# EAGLE design displayboard (EAGLE 6.6.0)
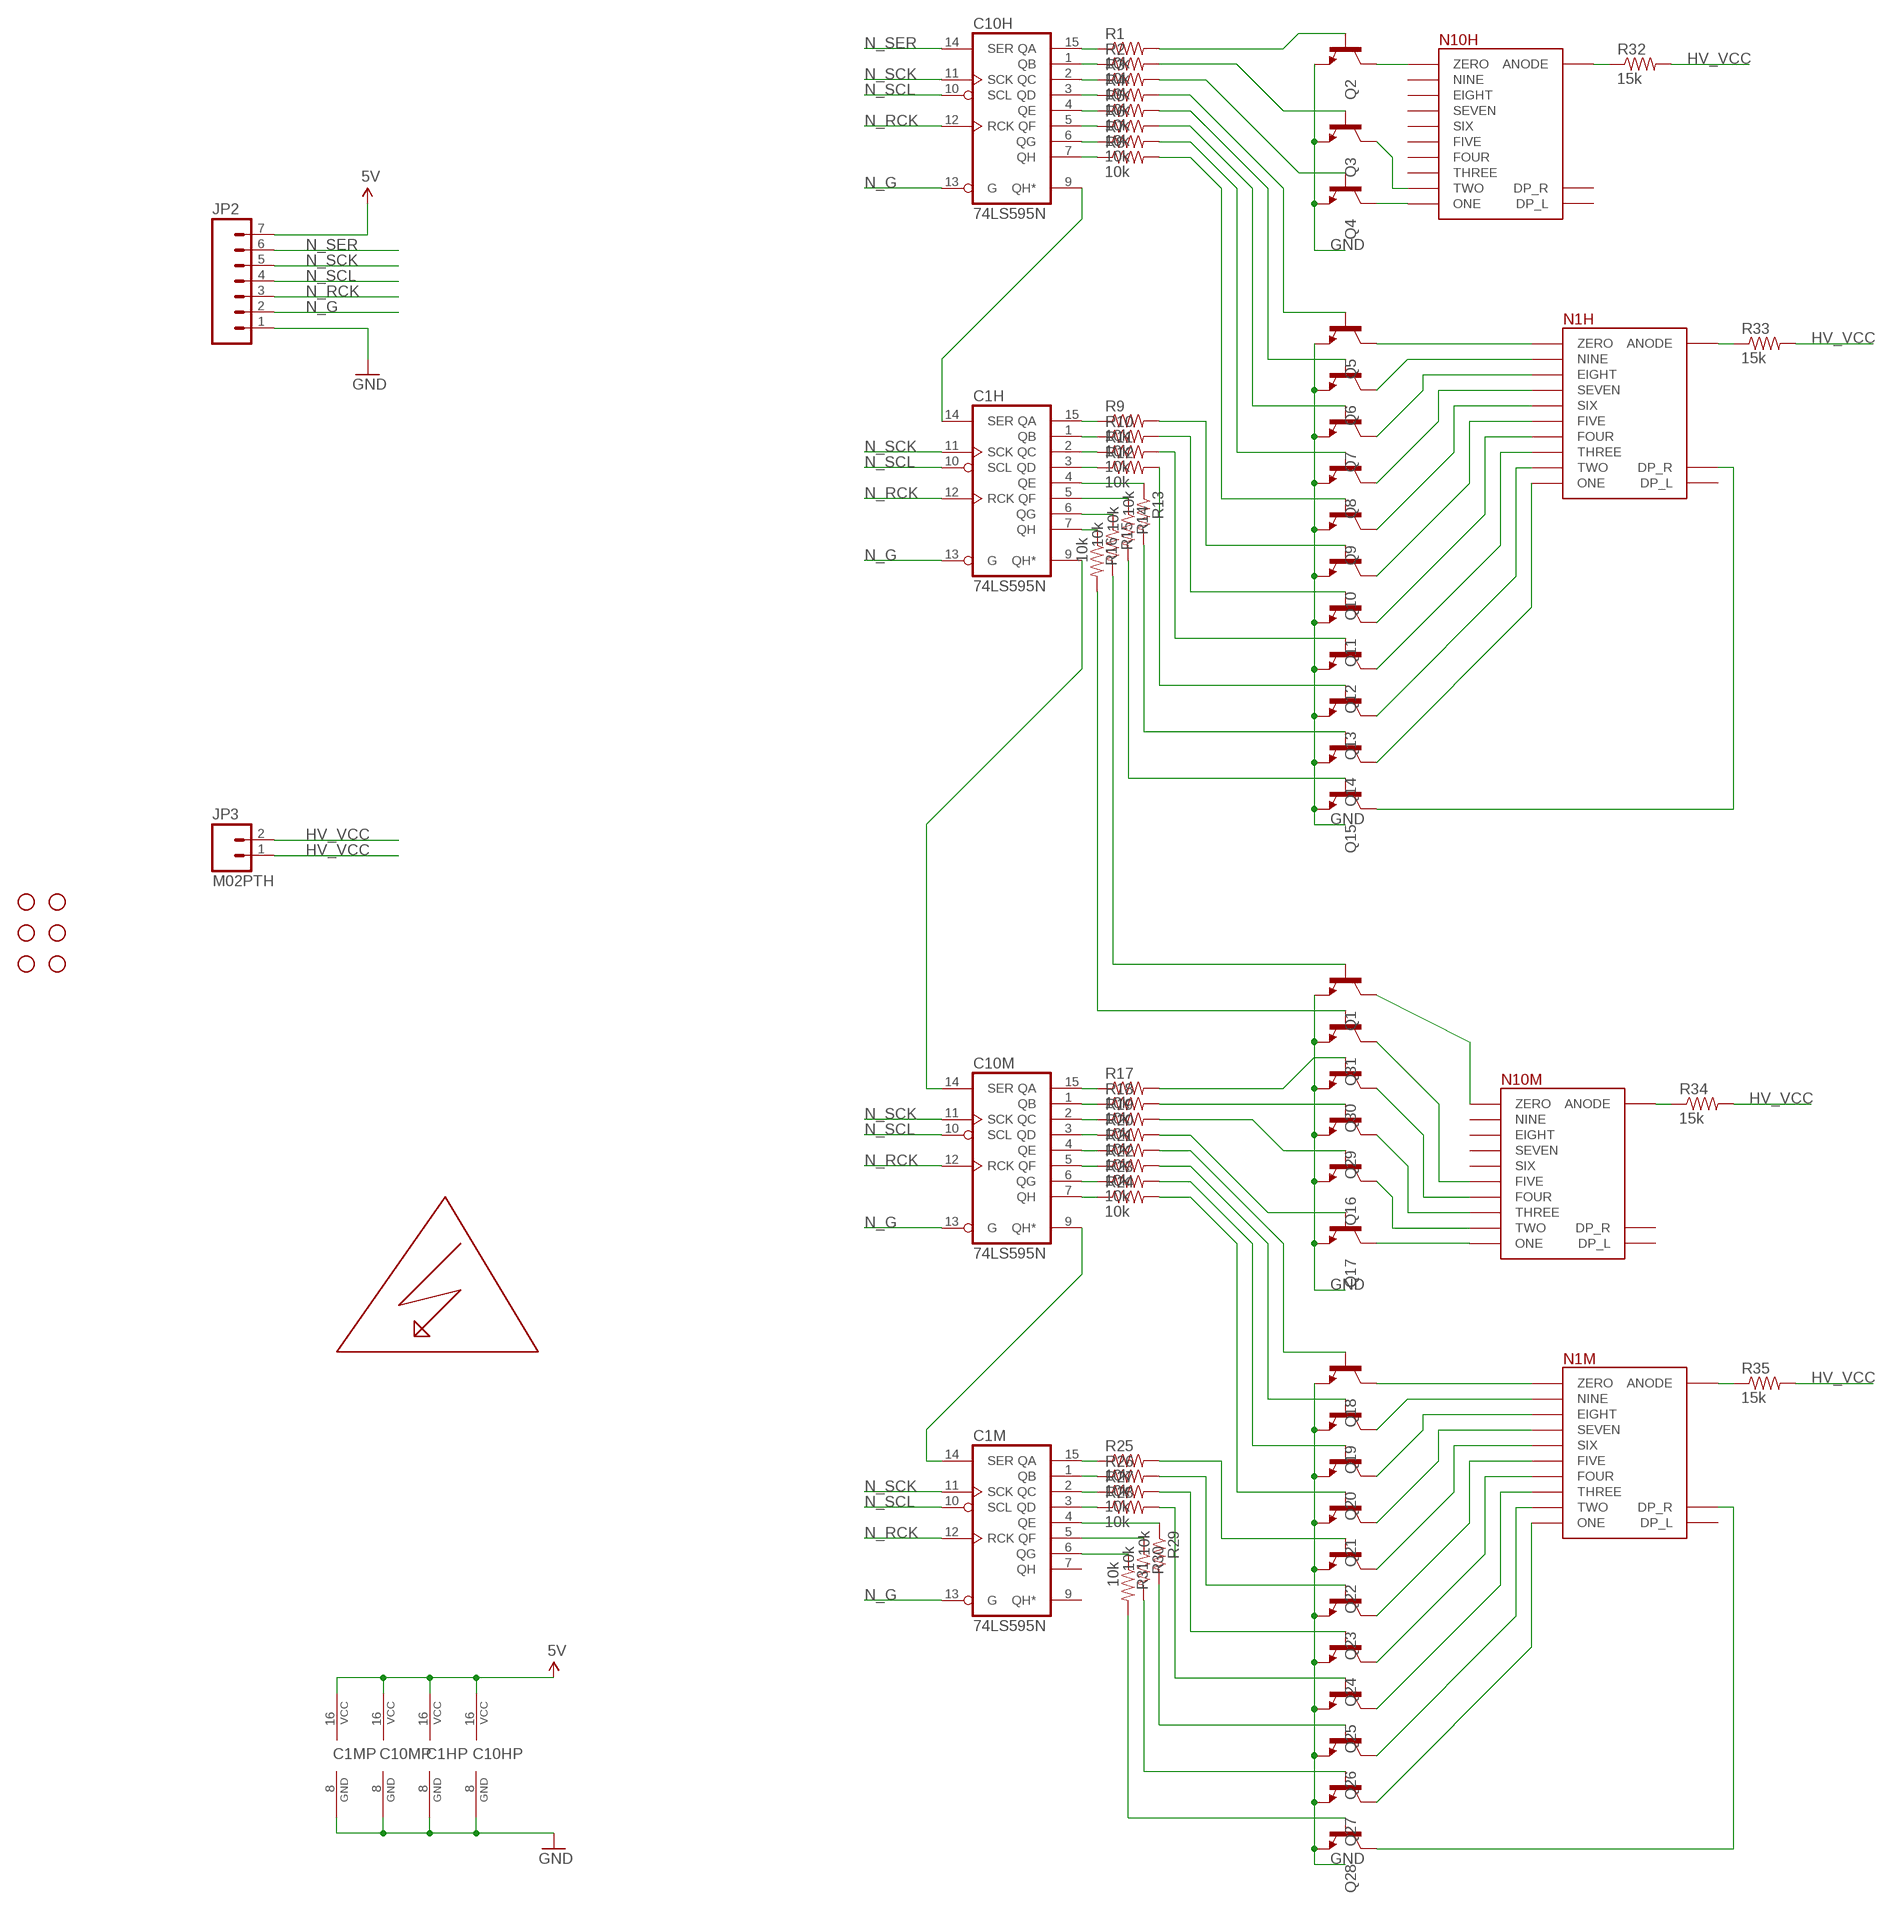
[diagram p0: schematic, sheet 1]

## Parts
C1H  74LS595N  [DIL16]
C1M  74LS595N  [DIL16]
C10H  74LS595N  [DIL16]
C10M  74LS595N  [DIL16]
JP2  M07  [1X07]
JP3  M02PTH  [1X02]
N1H  NIX13  [NIX13]
N1M  NIX13  [NIX13]
N10H  NIX13  [NIX13]
N10M  NIX13  [NIX13]
Q1  TRANSISTOR_NPNTO92  [TO-92]
Q2  TRANSISTOR_NPNTO92  [TO-92]
Q3  TRANSISTOR_NPNTO92  [TO-92]
Q4  TRANSISTOR_NPNTO92  [TO-92]
Q5  TRANSISTOR_NPNTO92  [TO-92]
Q6  TRANSISTOR_NPNTO92  [TO-92]
Q7  TRANSISTOR_NPNTO92  [TO-92]
Q8  TRANSISTOR_NPNTO92  [TO-92]
Q9  TRANSISTOR_NPNTO92  [TO-92]
Q10  TRANSISTOR_NPNTO92  [TO-92]
Q11  TRANSISTOR_NPNTO92  [TO-92]
Q12  TRANSISTOR_NPNTO92  [TO-92]
Q13  TRANSISTOR_NPNTO92  [TO-92]
Q14  TRANSISTOR_NPNTO92  [TO-92]
Q15  TRANSISTOR_NPNTO92  [TO-92]
Q16  TRANSISTOR_NPNTO92  [TO-92]
Q17  TRANSISTOR_NPNTO92  [TO-92]
Q18  TRANSISTOR_NPNTO92  [TO-92]
Q19  TRANSISTOR_NPNTO92  [TO-92]
Q20  TRANSISTOR_NPNTO92  [TO-92]
Q21  TRANSISTOR_NPNTO92  [TO-92]
Q22  TRANSISTOR_NPNTO92  [TO-92]
Q23  TRANSISTOR_NPNTO92  [TO-92]
Q24  TRANSISTOR_NPNTO92  [TO-92]
Q25  TRANSISTOR_NPNTO92  [TO-92]
Q26  TRANSISTOR_NPNTO92  [TO-92]
Q27  TRANSISTOR_NPNTO92  [TO-92]
Q28  TRANSISTOR_NPNTO92  [TO-92]
Q29  TRANSISTOR_NPNTO92  [TO-92]
Q30  TRANSISTOR_NPNTO92  [TO-92]
Q31  TRANSISTOR_NPNTO92  [TO-92]
R1  10k  R-US_0204/7  [0204/7]
R2  10k  R-US_0204/7  [0204/7]
R3  10k  R-US_0204/7  [0204/7]
R4  10k  R-US_0204/7  [0204/7]
R5  10k  R-US_0204/7  [0204/7]
R6  10k  R-US_0204/7  [0204/7]
R7  10k  R-US_0204/7  [0204/7]
R8  10k  R-US_0204/7  [0204/7]
R9  10k  R-US_0204/7  [0204/7]
R10  10k  R-US_0204/7  [0204/7]
R11  10k  R-US_0204/7  [0204/7]
R12  10k  R-US_0204/7  [0204/7]
R13  10k  R-US_0204/7  [0204/7]
R14  10k  R-US_0204/7  [0204/7]
R15  10k  R-US_0204/7  [0204/7]
R16  10k  R-US_0204/7  [0204/7]
R17  10k  R-US_0204/7  [0204/7]
R18  10k  R-US_0204/7  [0204/7]
R19  10k  R-US_0204/7  [0204/7]
R20  10k  R-US_0204/7  [0204/7]
R21  10k  R-US_0204/7  [0204/7]
R22  10k  R-US_0204/7  [0204/7]
R23  10k  R-US_0204/7  [0204/7]
R24  10k  R-US_0204/7  [0204/7]
R25  10k  R-US_0204/7  [0204/7]
R26  10k  R-US_0204/7  [0204/7]
R27  10k  R-US_0204/7  [0204/7]
R28  10k  R-US_0204/7  [0204/7]
R29  10k  R-US_0204/7  [0204/7]
R30  10k  R-US_0204/7  [0204/7]
R31  10k  R-US_0204/7  [0204/7]
R32  15k  R-US_0207/2V  [0207/2V]
R33  15k  R-US_0207/2V  [0207/2V]
R34  15k  R-US_0207/2V  [0207/2V]
R35  15k  R-US_0207/2V  [0207/2V]
STANDOFF1  STAND-OFF  [STAND-OFF]
STANDOFF2  STAND-OFF  [STAND-OFF]
STANDOFF3  STAND-OFF  [STAND-OFF]
STANDOFF4  STAND-OFF  [STAND-OFF]
STANDOFF5  STAND-OFF  [STAND-OFF]
STANDOFF6  STAND-OFF  [STAND-OFF]
U$1  HIGHVOLTAGE  [HIGHVOLTAGE]

## Nets
5V: C1H.16(VCC) C1M.16(VCC) C10H.16(VCC) C10M.16(VCC) JP2.7
GND: C1H.8(GND) C1M.8(GND) C10H.8(GND) C10M.8(GND) JP2.1 Q1.1(E) Q2.1(E) Q3.1(E) Q4.1(E) Q5.1(E) Q6.1(E) Q7.1(E) Q8.1(E) Q9.1(E) Q10.1(E) Q11.1(E) Q12.1(E) Q13.1(E) Q14.1(E) Q15.1(E) Q16.1(E) Q17.1(E) Q18.1(E) Q19.1(E) Q20.1(E) Q21.1(E) Q22.1(E) Q23.1(E) Q24.1(E) Q25.1(E) Q26.1(E) Q27.1(E) Q28.1(E) Q29.1(E) Q30.1(E) Q31.1(E)
HV_VCC: JP3.1 JP3.2 R32.2 R33.2 R34.2 R35.2
N$1: N10H.ONE Q4.3(C)
N$2: C10H.15(QA) R1.1
N$3: N10H.TWO Q3.3(C)
N$4: N10H.ZERO Q2.3(C)
N$5: N10M.THREE Q29.3(C)
N$6: N1H.ONE Q14.3(C)
N$7: N1H.TWO Q13.3(C)
N$8: N1H.THREE Q12.3(C)
N$9: N1H.FOUR Q11.3(C)
N$10: N1H.FIVE Q10.3(C)
N$11: N1H.SIX Q9.3(C)
N$12: N1H.SEVEN Q8.3(C)
N$13: N1H.EIGHT Q7.3(C)
N$14: N1H.NINE Q6.3(C)
N$15: N1H.ZERO Q5.3(C)
N$16: N10M.FOUR Q30.3(C)
N$17: N1H.DP_R Q15.3(C)
N$18: Q2.2(B) R1.2
N$19: Q3.2(B) R2.2
N$20: C10H.1(QB) R2.1
N$21: C10H.2(QC) R3.1
N$22: Q4.2(B) R3.2
N$23: Q5.2(B) R4.2
N$24: Q6.2(B) R5.2
N$25: Q7.2(B) R6.2
N$26: Q8.2(B) R7.2
N$27: Q9.2(B) R8.2
N$28: Q10.2(B) R9.2
N$29: Q11.2(B) R10.2
N$30: Q12.2(B) R11.2
N$31: Q13.2(B) R12.2
N$32: Q14.2(B) R13.2
N$33: Q15.2(B) R14.2
N$34: N10M.ONE Q17.3(C)
N$35: N10M.FIVE Q31.3(C)
N$36: Q1.2(B) R15.2
N$37: N1M.ONE Q27.3(C)
N$38: N1M.TWO Q26.3(C)
N$39: N1M.THREE Q25.3(C)
N$40: N1M.FOUR Q24.3(C)
N$41: N1M.FIVE Q23.3(C)
N$42: N1M.SIX Q22.3(C)
N$43: N1M.SEVEN Q21.3(C)
N$44: N1M.EIGHT Q20.3(C)
N$45: N1M.NINE Q19.3(C)
N$46: N1M.ZERO Q18.3(C)
N$47: N10M.TWO Q16.3(C)
N$48: N10M.ZERO Q1.3(C)
N$49: N1M.DP_R Q28.3(C)
N$50: Q30.2(B) R17.2
N$51: C10M.15(QA) R17.1
N$52: Q29.2(B) R18.2
N$53: C10H.3(QD) R4.1
N$54: C10H.4(QE) R5.1
N$55: C10H.5(QF) R6.1
N$56: C10H.6(QG) R7.1
N$57: Q22.2(B) R25.2
N$58: Q23.2(B) R26.2
N$59: Q24.2(B) R27.2
N$60: Q25.2(B) R28.2
N$61: Q26.2(B) R29.2
N$62: Q27.2(B) R30.2
N$63: Q28.2(B) R31.2
N$64: C1H.14(SER) C10H.9(QH*)
N$65: C1H.9(QH*) C10M.14(SER)
N$66: C1M.14(SER) C10M.9(QH*)
N$67: Q31.2(B) R16.2
N$68: Q17.2(B) R20.2
N$69: Q20.2(B) R23.2
N$70: Q18.2(B) R21.2
N$71: Q19.2(B) R22.2
N$72: Q21.2(B) R24.2
N$73: C10H.7(QH) R8.1
N$74: C1H.15(QA) R9.1
N$75: C1H.2(QC) R11.1
N$76: C1H.1(QB) R10.1
N$77: C1H.3(QD) R12.1
N$78: C1H.4(QE) R13.1
N$79: C1H.5(QF) R14.1
N$80: C1H.6(QG) R15.1
N$81: C1H.7(QH) R16.1
N$82: C10M.1(QB) R18.1
N$83: C10M.2(QC) R19.1
N$84: C10M.3(QD) R20.1
N$85: C10M.4(QE) R21.1
N$86: C10M.5(QF) R22.1
N$87: C10M.6(QG) R23.1
N$88: C10M.7(QH) R24.1
N$89: Q16.2(B) R19.2
N$90: C1M.15(QA) R25.1
N$91: C1M.1(QB) R26.1
N$92: C1M.2(QC) R27.1
N$93: C1M.3(QD) R28.1
N$94: C1M.4(QE) R29.1
N$95: C1M.5(QF) R30.1
N$96: C1M.6(QG) R31.1
N$97: N10H.ANODE R32.1
N$98: N1M.ANODE R35.1
N$99: N10M.ANODE R34.1
N$100: N1H.ANODE R33.1
N_G: C1H.13(G) C1M.13(G) C10H.13(G) C10M.13(G) JP2.2
N_RCK: C1H.12(RCK) C1M.12(RCK) C10H.12(RCK) C10M.12(RCK) JP2.3
N_SCK: C1H.11(SCK) C1M.11(SCK) C10H.11(SCK) C10M.11(SCK) JP2.5
N_SCL: C1H.10(SCL) C1M.10(SCL) C10H.10(SCL) C10M.10(SCL) JP2.4
N_SER: C10H.14(SER) JP2.6
Unconnected: C1M.7(QH) C1M.9(QH*) N1H.DP_L N1M.DP_L N10H.DP_L N10H.DP_R N10H.EIGHT N10H.FIVE N10H.FOUR N10H.NINE N10H.SEVEN N10H.SIX N10H.THREE N10M.DP_L N10M.DP_R N10M.EIGHT N10M.NINE N10M.SEVEN N10M.SIX

## Library data of the parts
C1H C1M C10H C10M = 74xx-us:74*595: 8-bit SHIFT REGISTER, output latch
JP2 = SparkFun-Connectors:M07: Header 7 Standard 7-pin 0.1" header. Use with straight break away headers (SKU : PRT-00116), right angle break away headers (PRT-00553), swiss pins (PRT-00743), machine pins (PRT-00117), and female headers (PRT-00115). NOTES ON THE VARIANTS LOCK and LOCK_LONGPADS... This footprint was designed to help hold the alignment of a through-hole component (i.e. 7-pin header) while soldering it into place. You may notice that each hole has been shifted either up or down by 0.005 of an inch from it's more standard position (which is usually a perfectly straight line). This slight alteration caused the pins (the squares in the middle) to touch the edges of the holes. Because they are alternating, it causes a "brace" to hold the header in place. 0.005 has proven to be the perfect amount of "off-center" position when using our standard breakaway headers. Although looks a little odd when you look at the bare footprint, once you have a header in there, the alteration is very hard to notice. Also, if you push a header all the way into place, it is covered up entirely on the bottom side. This idea of altering the position of holes to aid alignment will be further integrated into the Sparkfun Library for other footprints. It can help hold any component with 3 or more connection pins.
JP3 = SparkFun-Connectors:M02: Standard 2-pin 0.1" header. Use with - straight break away headers ( PRT-00116) - right angle break away headers (PRT-00553) - swiss pins (PRT-00743) - machine pins (PRT-00117) - female headers (PRT-00115) Molex polarized connector foot print use with: PRT-08233 with associated crimp pins and housings. 2.54_SCREWTERM for use with PRT-10571. 3.5mm Screw Terminal footprints for PRT-08084 5mm Screw Terminal footprints for use with PRT-08432
N1H N1M N10H N10M = nixie:NIX13
Q1-Q31 = SparkFun-DiscreteSemi:TRANSISTOR_NPN: Generic NPN BJT MMBT2222A - TRANS-08049 (SOT-23, 1A 40V) MPSA42 - TRANS-09116 (SOT-23, 500mA 300V) MMBT5088LT1G - TRANS-11160 (SOT-23, 50 mA 30V) BC547 - COM-08928 <http://www.sparkfun.com/products/8928> (TO-92 45V 100mA) (1.Collector 2.Base 3.Emitter) 2N3904 - COM-00521 <http://www.sparkfun.com/products/521> (TO-92 40V 200mA) (1.Emitter 2.Base 3.Collector) P2N2222A - COM-12852 <http://www.sparkfun.com/products/12852> (TO-92 40V 600mA) (1.Collector 2.Base 3.Emitter)
R1-R35 = resistor:R-US_: RESISTOR, American symbol
STANDOFF1-STANDOFF6 = SparkFun-Electromechanical:STAND-OFF: #4 Stand Off This is the mechanical footprint for a #4 phillips button head screw. Use the keepout ring to avoid running the screw head into surrounding components. SKU : PRT-00447
U$1 = highvoltage:HIGHVOLTAGE

## Net classes
1 power: width 0.762 mm, clearance 0.508 mm

## Board
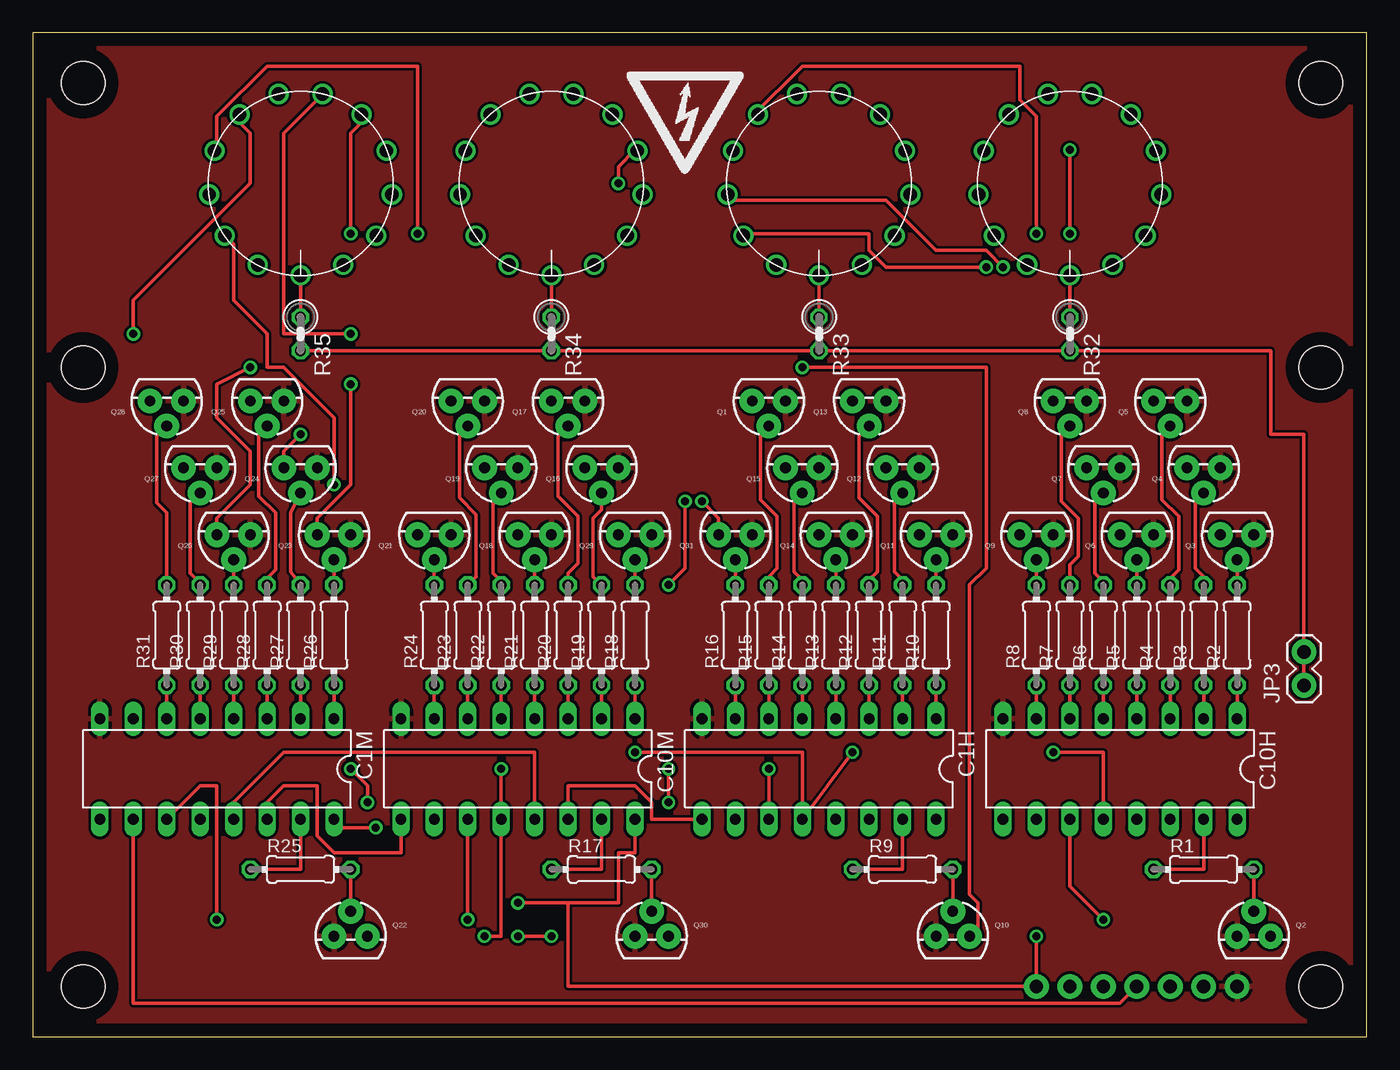
[diagram p1: board, top side]
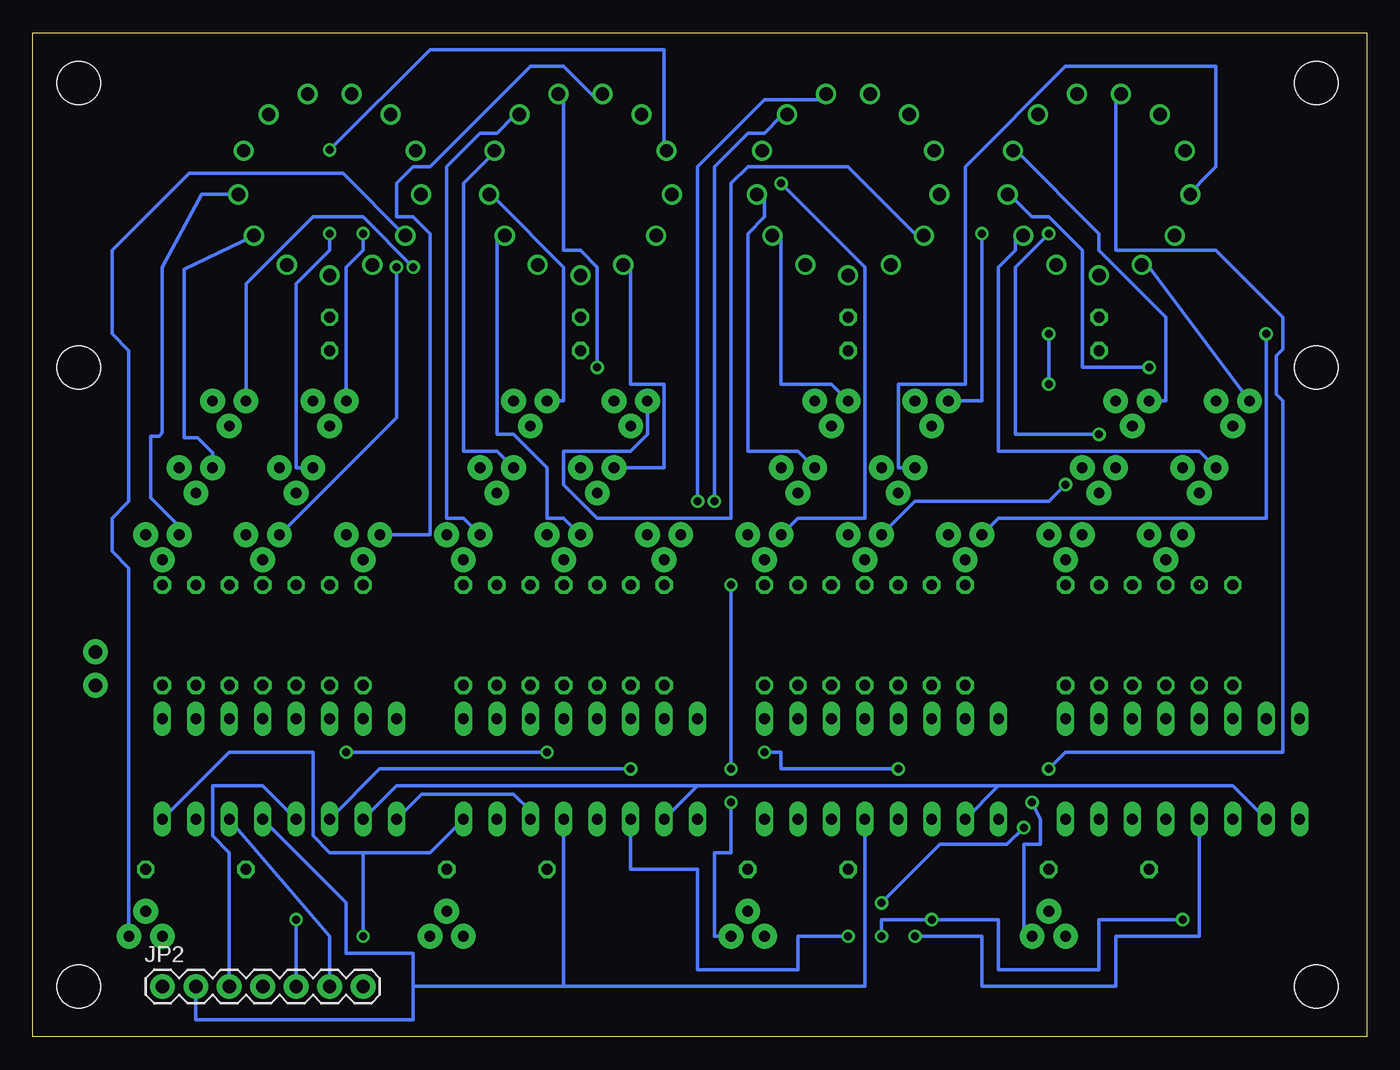
[diagram p2: board, bottom side, seen from below]

Size 101.27 x 76.19 mm. Coordinates in mm from the lower left corner, seen from the top.
Outline: 0,0 101.27,0 101.27,76.19 0,76.19 0,0
Copper layers (1*16): Top 0.035mm / dielectric 1.5mm / Bottom 0.035mm
Design rules "default": minimum track width 10mil, minimum drill 24mil, track to track 8mil, track to pad 8mil, pad to pad 8mil, via to via 8mil, smd to smd 8mil, copper to edge 40mil, drill to drill 8mil, minimum pad ring 10mil, minimum via ring 8mil, stop-mask expansion 4mil, vias tented up to drill 0mil, thermal gap 10mil

### Footprints (pad centres in the part's own frame; a part is rotated, then mirrored left to right if it is on the bottom)
DIL16 = drill 0.813 long: 1 -8.89,-3.81; 2 -6.35,-3.81; 3 -3.81,-3.81; 4 -1.27,-3.81; 5 1.27,-3.81; 6 3.81,-3.81; 7 6.35,-3.81; 8 8.89,-3.81; 9 8.89,3.81; 10 6.35,3.81; 11 3.81,3.81; 12 1.27,3.81; 13 -1.27,3.81; 14 -3.81,3.81; 15 -6.35,3.81; 16 -8.89,3.81
1X07 = drill 1.016 pad 1.88: 1 0,0; 2 2.54,0; 3 5.08,0; 4 7.62,0; 5 10.16,0; 6 12.7,0; 7 15.24,0
1X02 = drill 1.016 pad 1.88: 1 0,0; 2 2.54,0
NIX13 = drill 1.016: ANODE 0,6.985; DP_L -3.246,6.185; DP_R 3.246,6.185; EIGHT 6.531,-2.477; FIVE -1.672,-6.782; FOUR -4.632,-5.228; NINE 6.934,0.842; ONE -5.749,3.968; SEVEN 4.632,-5.228; SIX 1.672,-6.782; THREE -6.531,-2.477; TWO -6.934,0.842; ZERO 5.749,3.968
TO-92 = drill 0.813 pad 1.88: 1 -1.27,0; 2 0,1.905; 3 1.27,0
0204/7 = drill 0.813 octagon: 1 -3.81,0; 2 3.81,0
0207/2V = drill 0.813 octagon: 1 -1.27,0; 2 1.27,0
STAND-OFF = hole 3.302: 0,0

### Placement (x,y rotation side)
C1H  59.69,20.32 180 top
C1M  13.97,20.32 180 top
C10H  82.55,20.32 180 top
C10M  36.83,20.32 180 top
JP2  91.44,3.81 0 bottom
JP3  96.52,26.67 90 top
N1H  59.69,64.77 180 top
N1M  20.32,64.77 180 top
N10H  78.74,64.77 180 top
N10M  39.37,64.77 180 top
Q1  55.88,48.26 180 top
Q2  92.71,7.62 0 top
Q3  91.44,38.1 180 top
Q4  88.9,43.18 180 top
Q5  86.36,48.26 180 top
Q6  83.82,38.1 180 top
Q7  81.28,43.18 180 top
Q8  78.74,48.26 180 top
Q9  76.2,38.1 180 top
Q10  69.85,7.62 0 top
Q11  68.58,38.1 180 top
Q12  66.04,43.18 180 top
Q13  63.5,48.26 180 top
Q14  60.96,38.1 180 top
Q15  58.42,43.18 180 top
Q16  43.18,43.18 180 top
Q17  40.64,48.26 180 top
Q18  38.1,38.1 180 top
Q19  35.56,43.18 180 top
Q20  33.02,48.26 180 top
Q21  30.48,38.1 180 top
Q22  24.13,7.62 0 top
Q23  22.86,38.1 180 top
Q24  20.32,43.18 180 top
Q25  17.78,48.26 180 top
Q26  15.24,38.1 180 top
Q27  12.7,43.18 180 top
Q28  10.16,48.26 180 top
Q29  45.72,38.1 180 top
Q30  46.99,7.62 0 top
Q31  53.34,38.1 180 top
R1  88.9,12.7 0 top
R2  91.44,30.48 90 top
R3  88.9,30.48 90 top
R4  86.36,30.48 90 top
R5  83.82,30.48 90 top
R6  81.28,30.48 90 top
R7  78.74,30.48 90 top
R8  76.2,30.48 90 top
R9  66.04,12.7 0 top
R10  68.58,30.48 90 top
R11  66.04,30.48 90 top
R12  63.5,30.48 90 top
R13  60.96,30.48 90 top
R14  58.42,30.48 90 top
R15  55.88,30.48 90 top
R16  53.34,30.48 90 top
R17  43.18,12.7 0 top
R18  45.72,30.48 90 top
R19  43.18,30.48 90 top
R20  40.64,30.48 90 top
R21  38.1,30.48 90 top
R22  35.56,30.48 90 top
R23  33.02,30.48 90 top
R24  30.48,30.48 90 top
R25  20.32,12.7 0 top
R26  22.86,30.48 90 top
R27  20.32,30.48 90 top
R28  17.78,30.48 90 top
R29  15.24,30.48 90 top
R30  12.7,30.48 90 top
R31  10.16,30.48 90 top
R32  78.74,53.34 270 top
R33  59.69,53.34 270 top
R34  39.37,53.34 270 top
R35  20.32,53.34 270 top
STANDOFF1  3.81,72.39 0 top
STANDOFF2  97.79,72.39 0 top
STANDOFF3  97.79,3.81 0 top
STANDOFF4  3.81,3.81 0 top
STANDOFF5  3.81,50.8 0 top
STANDOFF6  97.79,50.8 0 top
U$1  53.98,73.79 180 top

### Tracks (layer width: path | path; a pad name or v marks a point on that pad's centre or on a via)
5V  (via drill 0.61)
  Top 0.254: v76.2,7.62 JP2.7 40.64,3.81 40.64,10.16 | C1M.16 22.86,15.88 v26.04,15.88 | v36.83,10.16 40.64,10.16 | 40.64,10.16 44.45,10.16 44.45,13.97 45.72,13.97 C10M.16
  Bottom 0.254: C10H.16 86.36,21.59 80.01,21.59 80.01,15.24 78.74,13.97 76.2,13.97 | C1H.16 71.12,13.97 76.2,13.97 | v76.2,7.62 76.2,13.97 | v26.04,15.88 27.3,14.61 32.38,14.61 v36.83,10.16
GND
  pour Top: 0,0 101.6,0 101.6,76.2 0,76.2
HV_VCC
  Top 0.254: JP3.1 JP3.2 96.52,45.72 93.98,45.72 93.98,52.07 R32.2 R33.2 R34.2 R35.2
N$1
  Bottom 0.254: N10H.ONE 89.79,58.26 89.79,45.47 88.77,45.47 87.63,44.32 Q4.3
N$2
  Top 0.254: C10H.15 88.9,12.7 R1.1
N$3
  Bottom 0.254: N10H.TWO 88.47,63.93 91.44,58.42 91.44,45.85 91.69,45.59 92.33,45.59 92.33,40.89 90.17,38.73 Q3.3
N$4
  Bottom 0.254: N10H.ZERO 77.72,65.53 89.41,65.53 95.25,59.69 95.25,53.34 93.98,52.07 93.98,40.64 95.25,39.37 95.25,36.83 93.98,35.56 Q2.3
N$5  (via drill 0.61)
  Top 0.254: v44.45,64.77 44.45,66.04 45.72,67.31 N10M.THREE
  Bottom 0.254: v44.45,64.77 38.1,58.42 38.1,39.37 43.18,39.37 Q29.3
N$6
  Bottom 0.254: Q14.3 60.96,39.37 62.23,39.37 62.23,43.18 64.77,45.72 66.04,45.72 66.04,60.96 N1H.ONE
N$7
  Bottom 0.254: Q13.3 60.96,48.26 60.96,58.42 66.04,63.5 N1H.TWO
N$8
  Bottom 0.254: Q12.3 66.04,44.45 68.58,44.45 68.58,64.77 66.04,67.31 N1H.THREE
N$9
  Bottom 0.254: Q11.3 68.58,39.37 69.85,39.37 69.85,66.04 67.31,68.58 66.04,68.58 64.77,69.85 N1H.FOUR
N$10  (via drill 0.61)
  Top 0.254: v58.42,50.8 72.39,50.8 72.39,35.56 71.12,34.29 71.12,10.79 71.75,10.16 71.75,8.26 Q10.3
  Bottom 0.254: v58.42,50.8 58.42,58.42 59.69,59.69 60.96,59.69 60.96,71.12 N1H.FIVE
N$11
  Bottom 0.254: Q9.3 71.12,38.1 71.12,60.96 72.39,62.23 73.66,62.23 73.66,64.77 72.39,66.04 71.12,66.04 63.5,73.66 60.96,73.66 58.42,71.12 N1H.SIX
N$12  (via drill 0.61)
  Top 0.254: v76.2,60.96 76.2,69.85 74.93,71.12 74.93,73.66 58.42,73.66 54.61,69.85 N1H.SEVEN
  Bottom 0.254: v76.2,60.96 76.2,59.69 77.47,58.42 Q8.3
N$13  (via drill 0.61)
  Top 0.254: v78.74,60.96 v78.74,67.31
  Bottom 0.254: v78.74,67.31 71.12,74.93 53.34,74.93 53.34,67.31 N1H.EIGHT | v78.74,60.96 78.74,59.69 81.28,57.15 81.28,43.18 Q7.3
N$14  (via drill 0.61)
  Top 0.254: v73.66,58.42 72.39,59.69 68.58,59.69 64.77,63.5 53.34,63.5 N1H.NINE
  Bottom 0.254: v73.66,58.42 73.66,46.99 Q6.3
N$15  (via drill 0.61)
  Top 0.254: v72.39,58.42 64.77,58.42 63.5,59.69 63.5,60.96 54.61,60.96 N1H.ZERO
  Bottom 0.254: v72.39,58.42 76.2,62.23 80.01,62.23 85.09,57.15 Q5.3
N$16  (via drill 0.61)
  Top 0.254: v49.53,40.64 49.53,35.56 v48.26,34.29 | v48.26,20.32 v48.26,17.78
  Bottom 0.254: v49.53,40.64 49.53,66.04 46.99,68.58 45.72,68.58 44.45,69.85 N10M.FOUR | Q30.3 49.53,7.62 49.53,13.97 48.26,13.97 v48.26,17.78 | v48.26,20.32 v48.26,34.29
N$17
  Bottom 0.254: Q15.3 53.34,43.18 53.34,49.53 55.88,49.53 55.88,58.42 N1H.DP_R
N$18
  Top 0.254: R1.2 Q2.2
N$19
  Top 0.254: R2.2 Q3.2
N$20
  Top 0.254: C10H.1 R2.1
N$21
  Top 0.254: R3.1 C10H.2
N$22
  Top 0.254: Q4.2 88.27,40.64 88.27,35.56 88.9,34.92 R3.2
N$23
  Top 0.254: Q5.2 85.72,45.72 85.72,40.77 87,39.5 87,35.43 86.36,34.8 R4.2
N$24
  Top 0.254: R5.2 Q6.2
N$25
  Top 0.254: Q7.2 80.64,40.64 80.64,35.18 81.28,34.54 R6.2
N$26
  Top 0.254: Q8.2 78.11,45.72 78.11,40.64 79.38,39.37 79.38,36.45 78.74,35.81 R7.2
N$27
  Top 0.254: R8.2 Q9.2
N$28
  Top 0.254: R9.2 Q10.2
N$29
  Top 0.254: R10.2 Q11.2
N$30
  Top 0.254: Q12.2 65.41,40.64 65.41,35.31 66.04,34.67 R11.2
N$31
  Top 0.254: Q13.2 62.74,45.59 62.74,40.89 64.14,39.5 64.14,35.31 63.5,34.67 R12.2
N$32
  Top 0.254: R13.2 Q14.2
N$33
  Top 0.254: Q15.2 57.78,40.64 57.78,35.31 58.42,34.67 R14.2
N$34
  Bottom 0.254: Q17.3 40.64,49.53 44.45,49.53 44.45,60.96 N10M.ONE
N$35  (via drill 0.61)
  Top 0.254: v50.8,40.64 52.07,39.37 Q31.3
  Bottom 0.254: v50.8,40.64 50.8,66.04 45.72,71.12 40.64,71.12 N10M.FIVE
N$36
  Top 0.254: Q1.2 55.24,45.72 55.24,40.77 56.52,39.5 56.52,35.56 55.88,34.92 R15.2
N$37
  Bottom 0.254: Q27.3 12.7,44.45 27.94,44.45 27.94,58.42 26.67,59.69 26.67,60.96 N1M.ONE
N$38  (via drill 0.61)
  Top 0.254: v16.51,50.8 13.97,49.53 13.97,46.99 16.51,44.45 16.51,41.91 13.97,39.37 Q26.3
  Bottom 0.254: v16.51,50.8 21.59,50.8 21.59,59.69 24.13,62.23 25.4,62.23 26.67,63.5 N1M.TWO
N$39
  Bottom 0.254: Q25.3 15.24,48.26 15.24,54.61 20.32,59.69 20.32,60.96 26.67,67.31 N1M.THREE
N$40  (via drill 0.61)
  Top 0.254: v24.13,60.96 24.13,68.58 25.4,69.85 N1M.FOUR | v20.32,45.72 19.05,44.45 Q24.3
  Bottom 0.254: v24.13,60.96 26.67,58.42 26.67,45.72 v20.32,45.72
N$41  (via drill 0.61)
  Top 0.254: Q23.3 21.59,39.37 24.13,41.91 v24.13,49.53 | N1M.FIVE 21.59,71.12 19.05,68.58 19.05,53.34 v24.13,53.34
  Bottom 0.254: v24.13,53.34 v24.13,49.53
N$42  (via drill 0.61)
  Top 0.254: v24.13,20.32 25.4,19.05 v25.4,17.78
  Bottom 0.254: v24.13,20.32 22.86,21.59 6.35,21.59 6.35,48.26 6.86,48.77 6.86,51.69 6.35,52.2 6.35,54.61 11.43,59.69 19.05,59.69 19.05,71.12 N1M.SIX | v25.4,17.78 24.77,16.51 24.77,14.61 26.04,14.61 26.04,8.26 Q22.3
N$43  (via drill 0.61)
  Top 0.254: N1M.SEVEN 15.24,69.85 16.51,68.58 16.51,64.77 7.62,55.88 v7.62,53.34
  Bottom 0.254: v7.62,53.34 7.62,39.37 27.94,39.37 Q21.3
N$44  (via drill 0.61)
  Top 0.254: v29.21,60.96 29.21,73.66 17.78,73.66 13.97,69.85 13.97,67.31 N1M.EIGHT
  Bottom 0.254: v29.21,60.96 29.21,48.26 Q20.3
N$45
  Bottom 0.254: Q19.3 35.56,43.18 35.56,49.53 30.48,49.53 30.48,66.04 22.86,73.66 11.43,73.66 11.43,66.04 13.97,63.5 N1M.NINE
N$46  (via drill 0.61)
  Top 0.254: v22.86,41.91 22.86,46.99 19.05,50.8 17.78,50.8 17.78,53.34 15.24,55.88 15.24,60.13 N1M.ZERO
  Bottom 0.254: v22.86,41.91 24.13,40.64 34.29,40.64 Q18.3
N$47
  Bottom 0.254: Q16.3 43.18,44.45 46.99,44.45 46.99,60.96 45.72,62.23 45.72,63.5 N10M.TWO
N$48
  Bottom 0.254: Q1.3 54.61,45.72 55.88,44.45 60.96,44.45 60.96,41.91 58.42,39.37 48.26,39.37 48.26,64.77 46.99,66.04 39.37,66.04 34.29,60.96 N10M.ZERO
N$49
  Bottom 0.254: Q28.3 16.51,58.42 N1M.DP_R
N$50
  Top 0.254: R17.2 Q30.2
N$51
  Top 0.254: C10M.15 43.18,12.7 R17.1
N$52
  Top 0.254: R18.2 Q29.2
N$53
  Top 0.254: C10H.3 R4.1
N$54
  Top 0.254: R5.1 C10H.4
N$55
  Top 0.254: R6.1 C10H.5
N$56
  Top 0.254: C10H.6 R7.1
N$57
  Top 0.254: R25.2 Q22.2
N$58
  Top 0.254: R26.2 Q23.2
N$59
  Top 0.254: Q24.2 19.56,39.75 19.56,35.31 R27.2
N$60
  Top 0.254: Q25.2 17.14,45.72 17.14,41.02 18.41,39.75 18.41,35.43 17.78,34.8 R28.2
N$61
  Top 0.254: R29.2 Q26.2
N$62  (1 unrouted)
  Top 0.254: Q27.2 11.94,40.51 11.94,35.18 12.7,34.42
N$63
  Top 0.254: Q28.2 9.4,45.59 9.4,40.51 10.16,39.75 R31.2
N$64
  Bottom 0.254: C1H.14 63.5,17.14 64.77,18.41 71.75,18.41 C10H.9
N$65
  Top 0.254: C10M.14 40.64,19.05 45.72,19.05 46.99,17.78 46.99,16.51 C1H.9
N$66
  Top 0.254: C1M.14 17.78,17.78 19.05,19.05 21.59,19.05 21.59,15.24 22.86,13.97 27.94,13.97 C10M.9
N$67
  Top 0.254: R16.2 Q31.2
N$68
  Top 0.254: Q17.2 39.88,45.59 39.88,41.02 41.4,39.5 41.4,35.94 40.64,35.18 R20.2
N$69
  Top 0.254: Q20.2 32.38,45.72 32.38,40.89 33.66,39.62 33.66,34.92 R23.2
N$70
  Top 0.254: R21.2 Q18.2
N$71
  Top 0.254: Q19.2 34.92,40.64 34.92,35.18 35.56,34.54 R22.2
N$72
  Top 0.254: R24.2 Q21.2
N$73
  Top 0.254: R8.1 C10H.7
N$74
  Top 0.254: C1H.15 66.04,12.7 R9.1
N$75
  Top 0.254: R11.1 C1H.2
N$76
  Top 0.254: R10.1 C1H.1
N$77
  Top 0.254: R12.1 C1H.3
N$78
  Top 0.254: R13.1 C1H.4
N$79
  Top 0.254: R14.1 C1H.5
N$80
  Top 0.254: R15.1 C1H.6
N$81
  Top 0.254: R16.1 C1H.7
N$82
  Top 0.254: R18.1 C10M.1
N$83
  Top 0.254: R19.1 C10M.2
N$84
  Top 0.254: R20.1 C10M.3
N$85
  Top 0.254: R21.1 C10M.4
N$86
  Top 0.254: R22.1 C10M.5
N$87
  Top 0.254: R23.1 C10M.6
N$88
  Top 0.254: R24.1 C10M.7
N$89
  Top 0.254: Q16.2 43.18,40.01 42.55,39.37 42.55,34.92 R19.2
N$90
  Top 0.254: C1M.15 20.32,12.7 R25.1
N$91
  Top 0.254: R26.1 C1M.1
N$92
  Top 0.254: R27.1 C1M.2
N$93
  Top 0.254: R28.1 C1M.3
N$94
  Top 0.254: R29.1 C1M.4
N$95
  Top 0.254: R30.1 C1M.5
N$96
  Top 0.254: R31.1 C1M.6
N$97
  Top 0.254: N10H.ANODE R32.1
N$98
  Top 0.254: R35.1 N1M.ANODE
N$99
  Top 0.254: R34.1 N10M.ANODE
N$100
  Top 0.254: R33.1 N1H.ANODE
N_G
  Top 0.254: C1M.13 15.24,17.78 19.05,21.59 38.1,21.59 C10M.13
  Bottom 0.254: C10H.13 77.47,10.16 77.47,6.35 72.39,6.35 72.39,3.81 | JP2.2 88.9,1.27 72.39,1.27 72.39,3.81 | 72.39,3.81 60.96,3.81 | C1H.13 60.96,3.81 | 60.96,3.81 38.1,3.81 C10M.13
N_RCK  (via drill 0.61)
  Top 0.254: v62.23,21.59 C1H.12 58.42,21.59 v45.72,21.59 | v77.47,21.59 81.28,21.59 C10H.12 | v34.29,7.62 35.56,7.62 C10M.12 v35.56,20.32
  Bottom 0.254: JP2.3 86.36,13.97 87.63,15.24 87.63,19.05 83.82,19.05 C10H.12 | v35.56,20.32 44.45,20.32 44.45,21.59 v45.72,21.59 | C1M.12 12.7,7.62 19.05,7.62 19.05,3.81 29.21,3.81 29.21,7.62 v34.29,7.62 | v62.23,21.59 v77.47,21.59
N_SCK  (via drill 0.61)
  Top 0.254: C1H.11 v55.88,20.32 | C1M.11 12.7,19.05 13.97,19.05 v13.97,8.89 | C10M.11 v33.02,8.89 | C10H.11 78.74,11.43 v81.28,8.89 | v36.83,7.62 v39.37,7.62
  Bottom 0.254: C10H.11 74.93,20.32 v55.88,20.32 | v81.28,8.89 JP2.5 | v36.83,7.62 36.83,8.89 v33.02,8.89 27.94,8.89 27.94,5.08 20.32,5.08 20.32,8.89 v13.97,8.89 | v39.37,7.62 43.18,7.62 43.18,5.08 50.8,5.08 50.8,12.7 55.88,12.7 C1H.11
N_SCL
  Top 0.254: C1M.10 7.62,2.54 82.55,2.54 JP2.4
  Bottom 0.254: C1M.10 10.16,19.05 27.94,19.05 | C10M.10 27.94,19.05 | 50.8,19.05 C1H.10 | 27.94,19.05 50.8,19.05 | C10H.10 73.66,19.05 50.8,19.05
N_SER
  Bottom 0.254: C10H.14 78.74,7.62 JP2.6